# Altium schematic sheet USB intrface.SchDoc
size A3; SheetNumber: 4; SheetTotal: 9
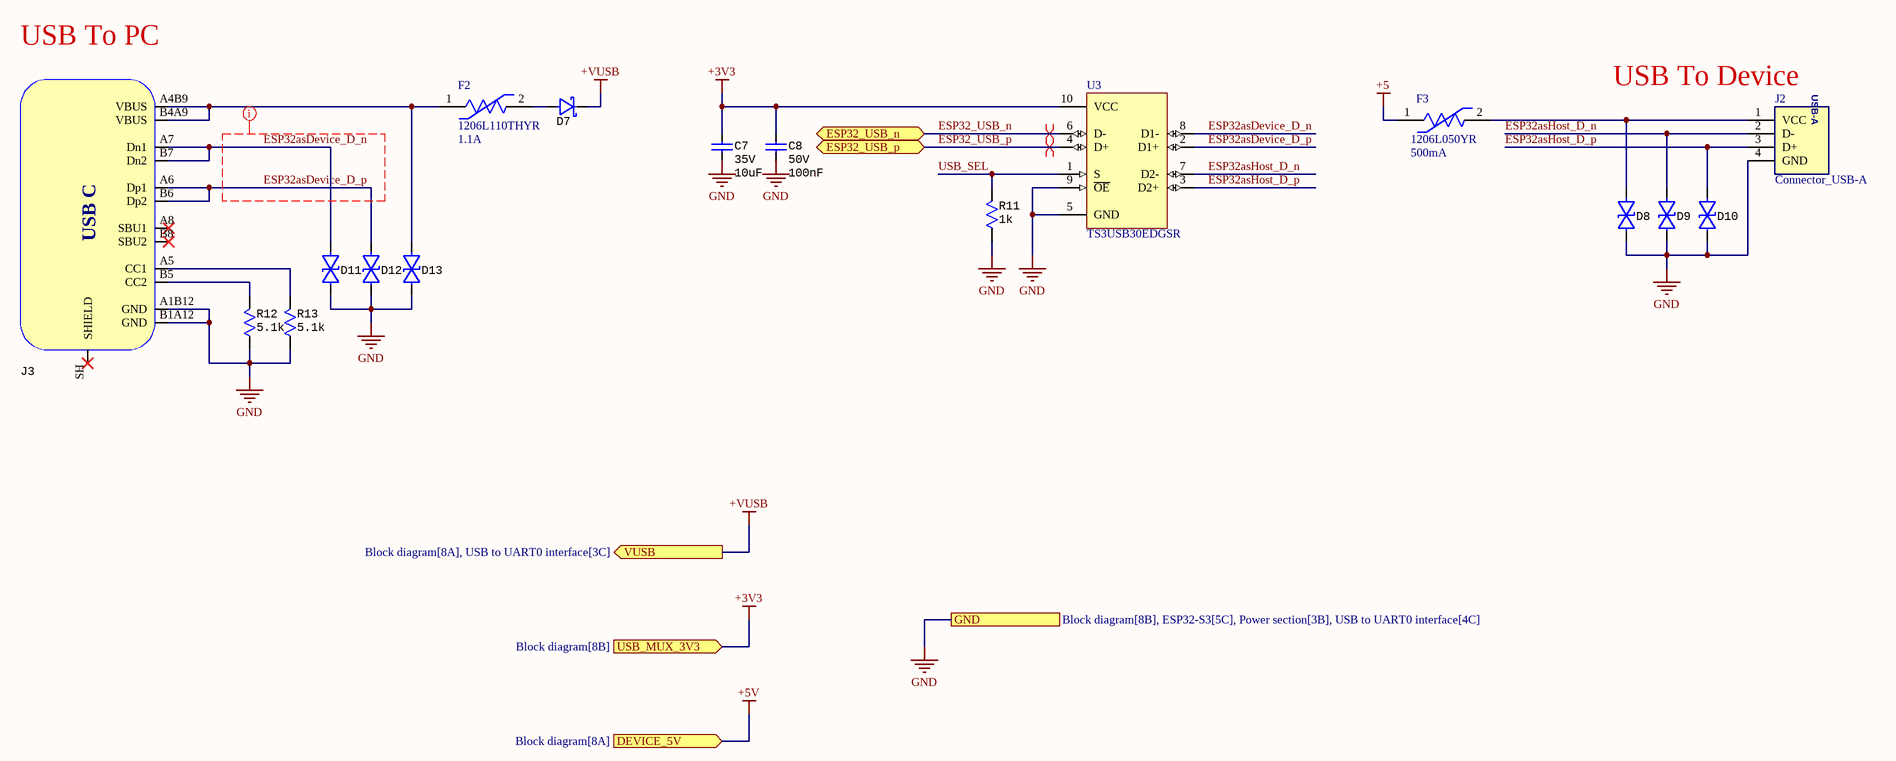
[diagram p0: USB intrface.SchDoc]

## Parts
C7  Voltage: 35V  [CAP Ceramic SMD 0603]  (hidden comment: 10uF)
C8  Voltage: 50V  [CAP Ceramic SMD 0603]  (hidden comment: 100nF)
D7  (no value)  [Diode Single SMD SOD123]
D8  (no value)  [Diode Single SMD SOD523]
D9  (no value)  [Diode Single SMD SOD523]
D10  (no value)  [Diode Single SMD SOD523]
D11  (no value)  [Diode Single SMD SOD523]
D12  (no value)  [Diode Single SMD SOD523]
D13  (no value)  [Diode Single SMD SOD523]
F2  1206L110THYR  Hold Current: 1.1A  [FUSE-1206]
F3  1206L050YR  Hold Current: 500mA  [FUSE-1206]
J2  Connector_USB-A  [USB-A/S_A]
J3  Connector_USB_Type_C_12Pin  [USB-C-31-M-12 (12PIN)]  (value not drawn)
R11  value 1k  [RES SMD 0603]  (hidden comment: 1kR)
R12  value 5.1k  [RES SMD 0603]  (hidden comment: 5.1kR)
R13  value 5.1k  [RES SMD 0603]  (hidden comment: 5.1kR)
U3  TS3USB30EDGSR  [VSSOP-10 _N]

## Ports
DEVICE_5V (in, see Block diagram[8A]), ESP32_USB_n (bidir, see Block diagram[7A]), ESP32_USB_p (bidir, see Block diagram[7A]), GND (see Block diagram[8B], ESP32-S3[5C], Power section[3B], USB to UART0 interface[4C]), USB_MUX_3V3 (in, see Block diagram[8B]), VUSB (out, see Block diagram[8A], USB to UART0 interface[3C])

## Nets
+3V3: C7.1 C8.1 U3.10(VCC) ; port USB_MUX_3V3
+5: F3.1
+5V: port DEVICE_5V
+VUSB: D7.2 ; port VUSB
GND: C7.2 C8.2 D8.1 D9.1 D10.1 D11.1 D12.1 D13.1 J2.4(GND) J3.A1B12(GND) J3.B1A12(GND) R11.1 R12.1 R13.1 U3.5(GND) U3.9(~{OE}) ; port GND
ESP32_USB_n: U3.6(D-) ; port ESP32_USB_n
ESP32_USB_p: U3.4(D+) ; port ESP32_USB_p
ESP32asDevice_D_n: D11.2 J3.A7(Dn1) J3.B7(Dn2) U3.8(D1-)
ESP32asDevice_D_p: D12.2 J3.A6(Dp1) J3.B6(Dp2) U3.2(D1+)
ESP32asHost_D_n: D9.2 J2.2(D-) U3.7(D2-)
ESP32asHost_D_p: D10.2 J2.3(D+) U3.3(D2+)
USB_SEL: R11.2 U3.1(S)
NetD7_1: D7.1 F2.2
NetD8_2: D8.2 F3.2 J2.1(VCC)
NetD13_2: D13.2 F2.1 J3.A4B9(VBUS) J3.B4A9(VBUS)
NetJ3_A5: J3.A5(CC1) R13.2
NetJ3_B5: J3.B5(CC2) R12.2

Not connected (* = marked no-connect by the designer): J3 A8(SBU1)* B8(SBU2)* SH(SHIELD)*

## Layout directives
differential pair: ESP32_USB_n, ESP32_USB_p
net class Diff90Ohm: ESP32asDevice_D_n, ESP32asDevice_D_p

## Notes on the sheet
- USB To PC
- (near J2) USB To Device
- (in symbol Connector_USB-A) USB-A
- (in symbol Connector_USB_Type_C_12Pin) USB C

## Library data of the parts
C7 = CAP 0603 10uF 35V: Cap Ceramic 10uF 35V X5R 20% Pad SMD 0603 85C T/R; Manufacturer: Murata; Manufacturer Part Number: GRM188R6YA106MA73D; Supplier 1: LCSC; RoHS: Yes; Category: Ceramic Capacitors; Mount: Surface Mount; Case/Package: 0603; Case Code (Metric): 1608; Case Code (Imperial): 0603; Min Operating Temperature: -55°C; Max Operating Temperature: 85°C; Packaging: Tape and Reel; Capacitance: 10uF; Voltage Rating: 35V; Tolerance: 20%; Dielectric: X5R; Voltage Rating (DC): 35V; Length: 0.063inch; Width: 0.031inch; Thickness: 0.039inch; RoHS Compliant: Yes; ComponentLink1URL: http://search.murata.co.jp/Ceramy/image/img/A01X/G101/ENG/GRM188R6YA106MA73-01.pdf?src-supplier=Future+Electronics; ComponentLink1Description: http://search.murata.co.jp/Ceramy/image/img/A01X/G101/ENG/GRM188R6YA106MA73-01.pdf?src-supplier=Future+Electronics; ComponentLink2URL: http://search.murata.co.jp/Ceramy/image/img/A01X/G101/ENG/GRM188R6YA106MA73-01.pdf?src-supplier=Digi-Key; ComponentLink2Description: http://search.murata.co.jp/Ceramy/image/img/A01X/G101/ENG/GRM188R6YA106MA73-01.pdf?src-supplier=Digi-Key; ComponentLink3URL: https://www.murata.com/~/media/webrenewal/support/library/catalog/products/capacitor/mlcc/c02e.ashx?la=en-us&src-supplier=Digi-Key; ComponentLink3Description: https://www.murata.com/~/media/webrenewal/support/library/catalog/products/capacitor/mlcc/c02e.ashx?la=en-us&src-supplier=Digi-Key; ComponentLink4URL: http://search.murata.co.jp/Ceramy/image/img/A01X/G101/ENG/GRM188R6YA106MA73-01.pdf?src-supplier=Mouser; ComponentLink4Description: http://search.murata.co.jp/Ceramy/image/img/A01X/G101/ENG/GRM188R6YA106MA73-01.pdf?src-supplier=Mouser; ComponentLink5URL: http://search.murata.co.jp/Ceramy/image/img/A01X/G101/ENG/GRM188R6YA106MA73-01.pdf?src-supplier=TTI; ComponentLink5Description: http://search.murata.co.jp/Ceramy/image/img/A01X/G101/ENG/GRM188R6YA106MA73-01.pdf?src-supplier=TTI; Supplier Part Number 1: C194427; Value: 10uF
C8 = CAP 0603 100nF 50V: Multilayer Ceramic Capacitors MLCC Surface Mount 0603 0.1uF 50 Volts X7R 10%; Manufacturer: Murata; Manufacturer Part Number: GRM188R71H104KA93D; Insulation Resistance: 10GR; Supplier 1: LCSC; RoHS: Yes; Category: Ceramic Capacitors; Stock 1: 3546650; Pricing 1: 50=0.00420, 500=0.00330, 1500=0.00290, 5000=0.00260, 25000=0.00250, 50000=0.00240 (USD); Mount: Surface Mount; Case/Package: 0603; Number of Pins: 2; Case Code (Imperial): 0603; Case Code (Metric): 1608; Dielectric Material: Ceramic; Material: Ceramic; Contact Plating: Tin,Matte; Min Operating Temperature: -55°C; Max Operating Temperature: 125°C; Capacitance: 100nF; Tolerance: 10%; Packaging: Tape and Reel; Dielectric: X7R; Voltage Rating (DC): 50V; Termination: SMD/SMT; Package Quantity: 1; Voltage Rating: 50V; Length: 1.6mm; Width: 0.8mm; Height: 0.8mm; Depth: 0.8mm; Thickness: 0.035inch; Radiation Hardening: No; RoHS Compliant: Yes; REACH SVHC: No SVHC; Lead Free: Lead Free; ComponentLink1URL: https://datasheet.ciiva.com/19467/1857604-19467681.pdf?src-supplier=Jameco; ComponentLink1Description: https://datasheet.ciiva.com/19467/1857604-19467681.pdf?src-supplier=Jameco; ComponentLink2URL: https://datasheet.ciiva.com/11786/0900766b807a1cab-11786047.pdf?src-supplier=RSComponents; ComponentLink2Description: https://datasheet.ciiva.com/11786/0900766b807a1cab-11786047.pdf?src-supplier=RSComponents; ComponentLink3URL: https://datasheet.ciiva.com/29201/451744-da-01-en-vs-kondensator-0603-29201904.pdf?src-supplier=Conrad; ComponentLink3Description: https://datasheet.ciiva.com/29201/451744-da-01-en-vs-kondensator-0603-29201904.pdf?src-supplier=Conrad; ComponentLink4URL: https://datasheet.ciiva.com/7937/4360-7937659.pdf?src-supplier=Element14; ComponentLink4Description: https://datasheet.ciiva.com/7937/4360-7937659.pdf?src-supplier=Element14; ComponentLink5URL: https://datasheet.ciiva.com/14116/nmgrm-data-en-14116602.pdf?src-supplier=Distrelec; ComponentLink5Description: https://datasheet.ciiva.com/14116/nmgrm-data-en-14116602.pdf?src-supplier=Distrelec; ComponentLink6URL: https://datasheet.ciiva.com/48436/nmgrm-data-en-48436667.pdf?src-supplier=Distrelec; ComponentLink6Description: https://datasheet.ciiva.com/48436/nmgrm-data-en-48436667.pdf?src-supplier=Distrelec; ComponentLink7URL: https://datasheet.ciiva.com/28534/4360-28534245.pdf?src-supplier=Element14; ComponentLink7Description: https://datasheet.ciiva.com/28534/4360-28534245.pdf?src-supplier=Element14; ComponentLink8URL: https://datasheet.ciiva.com/131/partnumbering-e-01-131739.pdf?src-supplier=Digi-Key; ComponentLink8Description: https://datasheet.ciiva.com/131/partnumbering-e-01-131739.pdf?src-supplier=Digi-Key; ComponentLink9URL: https://datasheet.ciiva.com/131/partnumbering-e-01-131738.pdf?src-supplier=Digi-Key; ComponentLink9Description: https://datasheet.ciiva.com/131/partnumbering-e-01-131738.pdf?src-supplier=Digi-Key; ComponentLink10URL: https://datasheet.ciiva.com/131/partnumbering-e-01-131740.pdf?src-supplier=Digi-Key; ComponentLink10Description: https://datasheet.ciiva.com/131/partnumbering-e-01-131740.pdf?src-supplier=Digi-Key; ComponentLink11URL: https://datasheet.ciiva.com/7937/1747470-7937658.pdf?src-supplier=Element14; ComponentLink11Description: https://datasheet.ciiva.com/7937/1747470-7937658.pdf?src-supplier=Element14; Supplier Part Number 1: C77055; Value: 100nF
D7 = B5819W: 40V 600mV@1A 1A SOD-123 Schottky Barrier Diodes (SBD) ROHS; Manufacturer: MCC; Manufacturer Part Number: B5819W-TP; Element Configuration: Single; Forward Voltage: 550mV; Max Reverse Voltage (DC): 20V; Max Forward Surge Current (Ifsm): 10A; Max Reverse Current: 1mA; Max Power Dissipation: 250mW; Supplier 1: LCSC; RoHS: Yes; Category: Rectifier Diodes; Stock 1: 8570; Pricing 1: 10=0.04150, 100=0.03440, 300=0.03090, 3000=0.02820, 6000=0.02610, 9000=0.02500 (USD); Mount: Surface Mount; Min Operating Temperature: -65°C; Max Operating Temperature: 125°C; Package Quantity: 3000; Packaging: Tape and Reel; Average Rectified Current: 1A; Series: -; Reverse Voltage (DC): 40V; Forward Current: 1A; Max Repetitive Reverse Voltage (Vrrm): 40V; RoHS Compliant: Yes; ComponentLink1URL: https://datasheet.ciiva.com/6378/b5817w-b5819wsod-123-6378255.pdf?src-supplier=Digi-Key; ComponentLink1Description: https://datasheet.ciiva.com/6378/b5817w-b5819wsod-123-6378255.pdf?src-supplier=Digi-Key; Supplier Part Number 1: C84354
D8-D13 = LESD5D5.0CT1G: Bi-Directional 9.4A 5V 18.6V 5.6V SOD-523 ESD Protection Devices ROHS; Manufacturer: UMW(Youtai Semiconductor); Supplier 1: LCSC; Manufacturer Part Number: LESD5D5.0CT1G; RoHS: No; Category: Uncategorized; Stock 1: 13940; Pricing 1: 20=0.02140, 200=0.01710, 600=0.01470, 3000=0.01330, 9000=0.01330, 21000=0.01330 (USD); Supplier Part Number 1: C5199850
F2 = 1206L110THYR: PTC RESET FUSE 8V 1.1A 1206; Manufacturer: Littelfuse; Trip Time: 0.1s; Trip Current: 2.2A; Value: 0.04-0.21Ω; Current Rating: 100A; Voltage Rating: 8V; Device Class L3: unset; Manufacturer Part Number: 1206L110THYR; ComponentLink2URL: https://m.littelfuse.com/~/media/electronics/datasheets/resettable_ptcs/littelfuse_ptc_1206l_datasheet.pdf.pdf; Height: 0.6mm; Temperature Range Low: -40°C; Automotive: No; Device Class L2: PTC Resettable Fuses; Device Class L1: Circuit Protection; Digikey Description: PTC RESET FUSE 8V 1.1A 1206; Octopart: https://octopart.com/1206l110thyr-littelfuse-11800142; Temperature Range High: +85°C; Category: Fuse; RoHS: TRUE; Ambient Temperature Range Low: -40°C; Mouser Description: Resettable Fuses - PPTC PTC 8V 1206 1.1A POLYFUSE SMD THIN; ComponentLink2Description: Datasheet; Ambient Temperature Range High: +85°C; Lead Free: Yes; Resistance: 0.04-0.21Ω; Temperature: -40°C to +85°C; Package: 1206L
F3 = 1206L050YR: PTC RESET FUSE 6V 500MA 1206; Trip Current: 1A; Current Rating: 100A; Resistance: 700mR; Approvals: cULus; Max Power Dissipation: 600mW; Time to Trip: 0.1s; Min Operating Temperature: -40°C; Voltage Rating (DC): 6V; Working Voltage: 6V; Package Quantity: 4000; Termination: SMD/SMT; Lead Free: Lead Free; REACH SVHC: No SVHC; Series: 1206L; Max Voltage Rating (DC): 6V; Height: 0.75mm; Terminal Material: Copper; Packaging: Tape and Reel; Case Code (Imperial): 1206; Length: 3.4mm; RoHS Compliant: Yes; Operating Supply Voltage: 6V; Case Code (Metric): 3216; Width: 1.8mm; Max Current Rating: 100A; Case/Package: 1206; Power Dissipation: 600mW; Max Operating Temperature: 85°C; Voltage Rating: 6V
J3 = Connector_USB_Type_C_12Pin: Korean Hroparts Elec / USB-Type-C / Num of contacts 16 / Surface Mount; ManufacturerPartNumber: TYPE-C-31-M-12; SuplierPartNumber: C165948; TypeConnector: USB Type C; CurrentMax: 3A; Manufacturer: Korean Hroparts; HelpURL: https://lcsc.com/product-detail/USB-Type-C_Korean-Hroparts-Elec-TYPE-C-31-M-12_C165948.html
R11 = RES 0603 1k 1%: Res Thick Film 0603 1K Ohm 1% 1/10W ±100ppm/°C Molded SMD Punched Carrier T/R; Manufacturer: Panasonic; Manufacturer Part Number: ERJ3EKF1001V; Power Rating: 100mW; Voltage Rating: 75V; Supplier 1: LCSC; RoHS: Yes; Category: Chip SMD Resistors; Stock 1: 79650; Pricing 1: 50=0.009600, 500=0.008100, 1500=0.007300, 5000=0.006800, 25000=0.006400, 50000=0.006200 (AUD); Mount: Surface Mount; Case/Package: 0603; Number of Pins: 2; Case Code (Metric): 1608; Case Code (Imperial): 0603; Contact Plating: Tin; Size Code: 0603; Min Operating Temperature: -55°C; Max Operating Temperature: 155°C; Packaging: Tape and Reel; Resistance: 1kR; Resistor Type: Thick Film; Temperature Coefficient: 100ppm/°C; Series: ERJ; Tolerance: 1%; Number of Terminations: 2; Max Power Dissipation: 100mW; Construction: Rectangular; Features: Automotive AEC-Q200; Package Quantity: 5000; Termination: SMD/SMT; Voltage Rating (DC): 75V; Resistance Tolerance: 1%; Technology: THICK FILM; Length: 1.6mm; Width: 0.8mm; Height: 0.45mm; Depth: 0.8mm; Radiation Hardening: No; RoHS Compliant: Yes; Lead Free: Lead Free; Military Standard: Not; REACH SVHC: No SVHC; ComponentLink1URL: https://datasheet.ciiva.com/7942/aoa0000ce2-7942427.pdf?src-supplier=Element14; ComponentLink1Description: https://datasheet.ciiva.com/7942/aoa0000ce2-7942427.pdf?src-supplier=Element14; ComponentLink2URL: https://datasheet.ciiva.com/46373/1678782-46373340.pdf?src-supplier=Element14; ComponentLink2Description: https://datasheet.ciiva.com/46373/1678782-46373340.pdf?src-supplier=Element14; ComponentLink3URL: https://datasheet.ciiva.com/22673/1678782-22673918.pdf?src-supplier=Element14; ComponentLink3Description: https://datasheet.ciiva.com/22673/1678782-22673918.pdf?src-supplier=Element14; ComponentLink4URL: https://datasheet.ciiva.com/46373/1678782-46373339.pdf?src-supplier=Element14; ComponentLink4Description: https://datasheet.ciiva.com/46373/1678782-46373339.pdf?src-supplier=Element14; ComponentLink5URL: https://datasheet.ciiva.com/24070/aoa0000ce2-24070269.pdf?src-supplier=Mouser; ComponentLink5Description: https://datasheet.ciiva.com/24070/aoa0000ce2-24070269.pdf?src-supplier=Mouser; ComponentLink6URL: https://datasheet.ciiva.com/16768/70260748-16768437.pdf?src-supplier=Allied+Electronics; ComponentLink6Description: https://datasheet.ciiva.com/16768/70260748-16768437.pdf?src-supplier=Allied+Electronics; ComponentLink7URL: https://datasheet.ciiva.com/16774/70260748-16774550.pdf?src-supplier=Allied+Electronics; ComponentLink7Description: https://datasheet.ciiva.com/16774/70260748-16774550.pdf?src-supplier=Allied+Electronics; ComponentLink8URL: https://datasheet.ciiva.com/9198/aoa0000ce2-9198923.pdf?src-supplier=Avnet; ComponentLink8Description: https://datasheet.ciiva.com/9198/aoa0000ce2-9198923.pdf?src-supplier=Avnet; ComponentLink9URL: https://datasheet.ciiva.com/16449/aoa0000ce2-16449065.pdf?src-supplier=Future+Electronics; ComponentLink9Description: https://datasheet.ciiva.com/16449/aoa0000ce2-16449065.pdf?src-supplier=Future+Electronics; ComponentLink10URL: https://datasheet.ciiva.com/48530/aoa0000ce2-48530987.pdf?src-supplier=Avnet; ComponentLink10Description: https://datasheet.ciiva.com/48530/aoa0000ce2-48530987.pdf?src-supplier=Avnet; ComponentLink11URL: https://datasheet.ciiva.com/30063/aoa0000ce2-30063390.pdf?src-supplier=Onlinecomponents.com; ComponentLink11Description: https://datasheet.ciiva.com/30063/aoa0000ce2-30063390.pdf?src-supplier=Onlinecomponents.com; Supplier Part Number 1: C118155
R12 R13 = RES 0603 5.1k 1%: Res Thick Film 0603 5.1K Ohm 1% 1/10W ±100ppm/°C Molded SMD SMD Paper T/R; Manufacturer: Vishay; Manufacturer Part Number: CRCW06035K10FKEA; Max Power Dissipation: 100mW; Voltage Rating (DC): 75V; Supplier 1: LCSC; RoHS: Yes; Category: Chip SMD Resistors; Stock 1: 3800; Pricing 1: 50=0.017200, 500=0.013100, 1500=0.011300, 5000=0.010700, 25000=0.009300, 50000=0.009200 (AUD); Mount: Surface Mount; Case/Package: 0603; Case Code (Imperial): 0603; Case Code (Metric): 1608; Contact Plating: Tin; Size Code: 0603; Weight: 7.1E-05oz; Min Operating Temperature: -55°C; Max Operating Temperature: 155°C; Packaging: Tape and Reel; Resistance: 5.1kR; Tolerance: 1%; Temperature Coefficient: 100ppm/°C; Resistor Type: Thick Film; Series: CRCW; Number of Terminations: 2; Package Quantity: 5000; Power Rating: 100mW; Voltage Rating: 75V; Construction: Rectangular; Features: Automotive AEC-Q200; Termination: SMD/SMT; Resistance Tolerance: 1%; Technology: THICK FILM; Length: 1.55mm; Width: 0.85mm; Height: 0.45mm; Depth: 0.85mm; Radiation Hardening: No; RoHS Compliant: Yes; Lead Free: Lead Free; Military Standard: Not; REACH SVHC: Unknown; ComponentLink1URL: https://datasheet.ciiva.com/11809/0900766b80d98afc-11809935.pdf?src-supplier=RSComponents; ComponentLink1Description: https://datasheet.ciiva.com/11809/0900766b80d98afc-11809935.pdf?src-supplier=RSComponents; ComponentLink2URL: https://datasheet.ciiva.com/26314/fld-crcw-e3-data-en-26314742.pdf?src-supplier=Distrelec; ComponentLink2Description: https://datasheet.ciiva.com/26314/fld-crcw-e3-data-en-26314742.pdf?src-supplier=Distrelec; ComponentLink3URL: https://datasheet.ciiva.com/7690/1697337-7690728.pdf?src-supplier=Element14; ComponentLink3Description: https://datasheet.ciiva.com/7690/1697337-7690728.pdf?src-supplier=Element14; ComponentLink4URL: https://datasheet.ciiva.com/7690/1720486-7690873.pdf?src-supplier=Element14; ComponentLink4Description: https://datasheet.ciiva.com/7690/1720486-7690873.pdf?src-supplier=Element14; ComponentLink5URL: https://datasheet.ciiva.com/15159/getdatasheetpartid-32793-15159338.pdf?src-supplier=Verical; ComponentLink5Description: https://datasheet.ciiva.com/15159/getdatasheetpartid-32793-15159338.pdf?src-supplier=Verical; ComponentLink6URL: https://datasheet.ciiva.com/3257/dcrcwe3-3257758.pdf?src-supplier=Avnet; ComponentLink6Description: https://datasheet.ciiva.com/3257/dcrcwe3-3257758.pdf?src-supplier=Avnet; ComponentLink7URL: https://datasheet.ciiva.com/16226/dcrcwe3-16226862.pdf?src-supplier=Future+Electronics; ComponentLink7Description: https://datasheet.ciiva.com/16226/dcrcwe3-16226862.pdf?src-supplier=Future+Electronics; Supplier Part Number 1: C844933
U3 = TS3USB30EDGSR: High-Speed USB 2.0 (480-Mbps) 1:2 Multiplexer / Demultiplexer Switch with Single, 10 ohm RON, 3.0 to 4.3V, -40 to 85 degC, 10-Pin MSOP (DGS), Green (RoHS & no Sb/Br); Manufacturer: Texas Instruments; Architecture: "1","2 mux/demux"; tpd max(ns): 0.25; ICC(uA): 1; IL OFF(Max)(nA): 2; OFF Time(Max)(ns): 30; SubFamily: USB Switch; ESD HBM(kV): +/-8; Bandwidth(MHz): 900; RON Mis-match(Max)(Ohms): 0.35; ON Time(Max)(ns): 25; ron(max)(ohms): 10; PartNumber: TS3USB30EDGSR; ComponentLink1URL: http://www.ti.com/general/docs/lit/getliterature.tsp?genericPartNumber=TS3USB30E&fileType=pdf; Vcc range(V): 3.0 to 4.3; PackageReference: DGS0010A; Code_JEDEC: MO-187-BA; PackageDescription: 10-Pin Thin Shrink Small Outline Package 0.5 mm Pitch; Eco-Plan: Green (RoHS & no Sb/Br); ComponentLink2URL: http://www.ti.com/litv/pdf/mpds035b; Number of Channels: 2; Mounting Technology: Surface Mount; PackageVersion: revC, Feb-2004; DatasheetVersion: SCDS255D; ComponentLink1Description: Datasheet; ComponentLink2Description: Package Specification; RON Flatness(Max)(Ohms): 2